# Altium project EinkFootPedal.PrjPcb
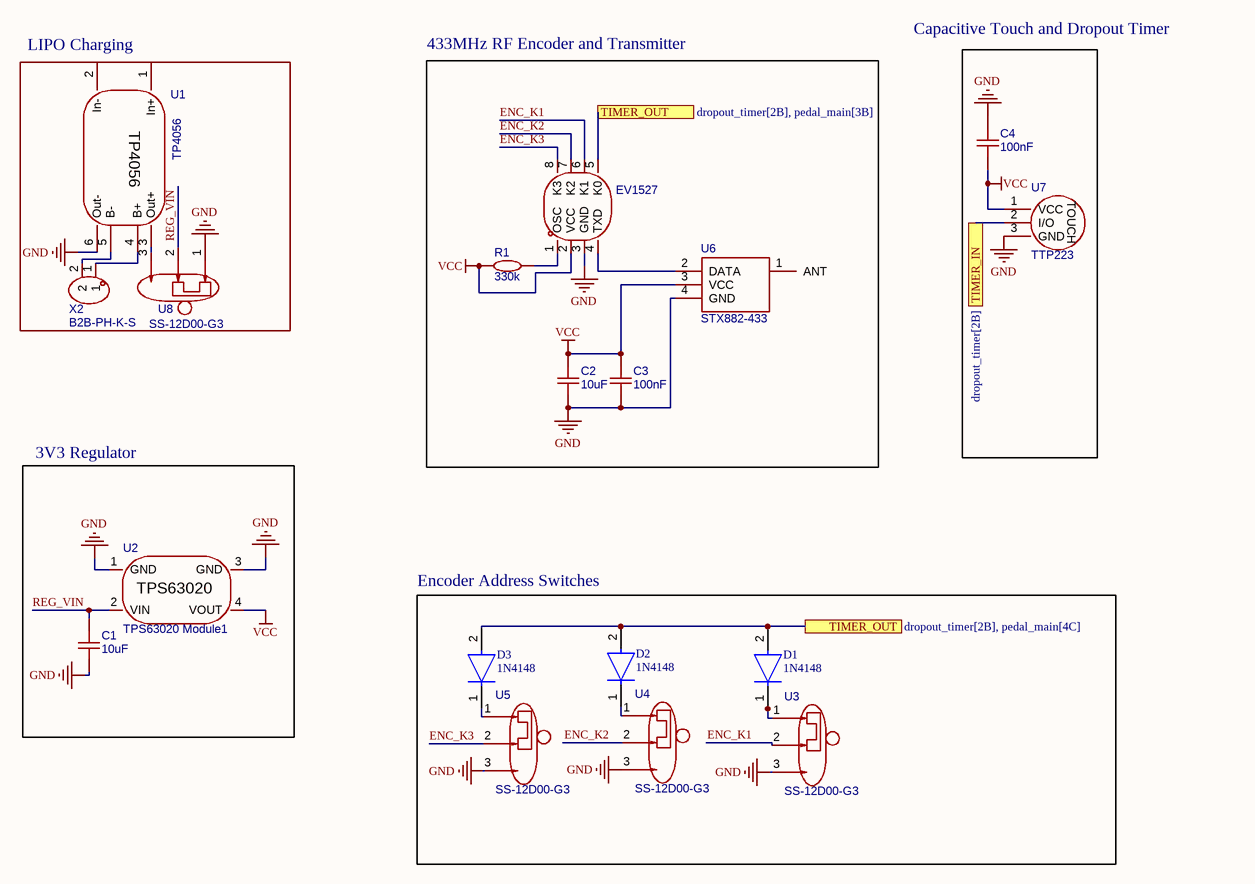
[diagram p0: pedal_main.SchDoc]
2 sheets, 23 parts. Net scope: flat (ports and power ports of the same name join across sheets).
Board file: pedal_pcb.PcbDoc
Sheets:
  pedal_main.SchDoc
  dropout_timer.SchDoc

## Sheet pedal_main.SchDoc
size B; SheetNumber: 1; SheetTotal: 2

### Parts
C1  10uF  [C0603]
C2  10uF  [C0603]
C3  100nF  [C0603]
C4  100nF  [C0603]
D1  1N4148  [FP-017AG-MFG]
D2  1N4148  [FP-017AG-MFG]
D3  1N4148  [FP-017AG-MFG]
R1  330k  [R0603]
U1  TP4056  [BATTMODULE]
U2  TPS63020 Module1  [TPS63020 MODULE AIOT]
U3  SS-12D00-G3  [SW-TH_3P-L8.8-W3.9-P2.50_SS12D00G3]
U4  SS-12D00-G3  [SW-TH_3P-L8.8-W3.9-P2.50_SS12D00G3]
U5  SS-12D00-G3  [SW-TH_3P-L8.8-W3.9-P2.50_SS12D00G3]
U6  STX882-433  [STX882_NiceRF_12x15.2]
U7  TTP223  [TTP223]
U8  SS-12D00-G3  [SW-TH_3P-L8.8-W3.9-P2.50_SS12D00G3]
X2  B2B-PH-K-S  [CONN-TH_B2B-PH-K-S]
  EV1527  [SOP-8_L4.9-W3.9-P1.27-LS6.0-TL]

### Blocks framed on the sheet
433MHz RF Encoder and Transmitter: C2 C3 R1 U6 
LIPO Charging: U1 U8 X2
3V3 Regulator: C1 U2
Encoder Address Switches: D1-D3 U3-U5

### Ports
TIMER_IN (see dropout_timer[2B]), TIMER_OUT (see dropout_timer[2B], pedal_main[3B]), TIMER_OUT (see dropout_timer[2B], pedal_main[4C])

### Nets
GND: C1.2 C2.2 C3.2 C4.2 U1.6(Out-) U2.1(GND) U2.3(GND) U3.3 U4.3 U5.3 U6.4(GND) U7.3(GND) U8.1 .3(GND)
VCC: C2.1 C3.1 C4.1 R1.1 U2.4(VOUT) U6.3(VCC) U7.1(VCC) .2(VCC)
ENC_K1: U3.2 .6(K1)
ENC_K2: U4.2 .7(K2)
ENC_K3: U5.2 .8(K3)
REG_VIN: C1.1 U2.2(VIN) U8.2
TIMER_VIN: U7.2(I/O) ; port TIMER_IN
NetD1_1: D1.1(C) U3.1
NetD1_2: D1.2(A) D2.2(A) D3.2(A) .5(K0) ; port TIMER_OUT
NetD2_1: D2.1(C) U4.1
NetD3_1: D3.1(C) U5.1
NetR1_2: R1.2 .1(OSC)
NetU1_3: U1.3(Out+) U8.3
NetU1_4: U1.4(B+) X2.1
NetU1_5: U1.5(B-) X2.2
NetU6_2: U6.2(DATA) .4(TXD)

Not connected (* = marked no-connect by the designer): U1 1(In+) 2(In-); U6 1(ANT)

### Notes on the sheet
- Capacitive Touch and Dropout Timer
- DWG. NO.
- REV.
- SHT.
- THIS DOCUMENT AND THE DATA DISCLOSED HEREIN OR HEREWITH IS THE PROPERTY OF ALTIUM LIMITED AND MAY BE FREELY DISTRIBUTED IN WHOLE. NO RIGHTS ARE RESERVED OR EXPRESS OR IMPLIED WARANTEE GIVEN.
- REVISION
- DESCRIPTION
- DATE
- APPROVED
- ENG:
- APPROVALS
- PROJECT
- DSN:
- CHK:
- REFERENCE DOCUMENTS
- PROJECT REVISION:
- TITLE
- DOCUMENT REVISION:
- DESIGN ITEM:
- BOM:
- FAB DWG:
- PCB DWG:
- ASSY DWG:
- SCALE:
- SIZE
- B
- CAGE CODE
- FILE NAME
- DWG NO.
- SHEET
- OF
- REV
- (in symbol TTP223) TOUCH

### Library data of the parts
C1 C2 = CAP_0603: Symbol: CAP_OLD; ConvertToPcb: yes; ModelId: 624118aa3cc7497086c383c2d72e0852ÂŽ0819f05c4eef4c71ace90d822a990e87; ModelName: C0603_L1.6-W0.8-H0.8; ModelTransform: 62.992,31.496,0,0,0,0,0,0,0; Device: CAP_0603; Value: 10uF; AddInBom: yes; Supplier Footprint: 0603; FootprintName: C0603
C3 C4 = CAP_0603_1: Symbol: CAP_OLD; ConvertToPcb: yes; ModelId: 624118aa3cc7497086c383c2d72e0852ÂŽ0819f05c4eef4c71ace90d822a990e87; ModelName: C0603_L1.6-W0.8-H0.8; ModelTransform: 62.992,31.496,0,0,0,0,0,0,0; Device: CAP_0603; AddInBom: yes; Supplier Footprint: 0603; FootprintName: C0603; Value: 100nF
D1-D3 = CMP-07163-000046-1: DIODE GEN PURP 100V 200MA DO35; Forward Voltage: 1V; Max Power Dissipation: 500mW; Max Reverse Current: 5uA; Forward Current: 300mA; Current: 4A; Reverse Recovery Time: 4ns; Element Configuration: Single; Outside Diameter: 1.85mm; Capacitance: 4pF; Polarity: Standard; Max Forward Surge Current (Ifsm): 1A; Reverse Voltage: 100V; Output Current: 200mA; Average Rectified Current: 200mA; Diameter: 1.91mm; Max Repetitive Reverse Voltage (Vrrm): 100V; Current Rating: 200mA; Case/Package: DO-35; Lead Free: Lead Free; Number of Pins: 2; Recovery Time: 4ns; Packaging: Bulk; Contact Plating: Tin; Voltage: 100V; Mount: Through Hole; Max Surge Current: 4A; Package Quantity: 2000; Width: 1.91mm; Max Reverse Voltage (DC): 100V; Length: 4.56mm; Radiation Hardening: No; Power Dissipation: 500mW; Voltage Rating (DC): 100V; Peak Non-Repetitive Surge Current: 4A; REACH SVHC: No SVHC; Height: 4.56mm; Max Operating Temperature: 175°C; Series: -; Weight: 0.01lb; Min Operating Temperature: -65°C
R1 = Res_0603: Symbol: Res; ConvertToPcb: yes; ModelId: 112863783b5b41f1b5254f87eedc7932ÂŽ0819f05c4eef4c71ace90d822a990e87; ModelTransform: 31.8897,63.7794,0,90,0,0,0,0,0; Device: Res_0603; Value: 330k; AddInBom: yes; Supplier Footprint: 0603; FootprintName: R0603; ModelName: R0603
U1 = TP4056: ManufacturerPart: TP4056 Lithium Battery Charger Module; AddInBom: yes; ModelId: e423d71e48284fa8aca64bd540eddcc7ÂŽ12eb6a14b26044868d603fa342c20fc9; ModelTransform: 1123.969599391241,677.16402,166.0550894347883,0,0,0,519.68504,330.70866,0; Symbol: TP4056; Device: TP4056; ConvertToPcb: yes; FootprintName: BATTMODULE; ModelName: TP4056
U2 = TPS63020: TPS63020 (Buck-Boost); AddInBom: yes; Symbol: TPS63020; Device: TPS63020; ConvertToPcb: yes; FootprintName: TPS63020 MODULE AIOT
U3-U5 U8 = SS-12D00-G3: Circuit:SPDT Actuator Style:Rectangular Columnar Termination Style:PC Pin Length:8.8mm Width:3.9mm Switch Height:7.2mm Mounting Type:Through Hole Actuator Color:Black Operating Temperature:-35℃~+75℃ Operating Temperature:-35℃~+75℃; Manufacturer: SOFNG(硕方); AddInBom: yes; ModelId: 73abde54055d465790e8480c42fb2657ÂŽ0819f05c4eef4c71ace90d822a990e87; ModelTransform: 346.495,153.54304,0,0,0,0,0,0,-102.362; Circuit: SPDT; Switch Height: 7.2mm; Actuator Color: Black; Symbol: SS-12D00-G3; Device: SS-12D00-G3; LCSC Part Name: 大型拨动开关; SupplierPart: C22355741; ManufacturerPart: SS-12D00-G3; Supplier Footprint: 插件-3P,8.8x3.9mm; JLCPCB Part Class: Extended Part; Datasheet: https://item.szlcsc.com/datasheet/SS-12D00-G3/23787622.html; Supplier: LCSC; ConvertToPcb: yes; FootprintName: SW-TH_3P-L8.8-W3.9-P2.50_SS12D00G3; ModelName: SW-TH_3P-L8.8-W3.9-P2.50_SS12D00G3; Actuator Style: Rectangular Columnar; Termination Style: PC Pin; Length: 8.8mm; Width: 3.9mm; Mounting Type: Through Hole; Operating Temperature: -35℃~+75℃
U6 = STX882-433: NiceRF STX882 433.92MHz ASK/OOK transmitter, 12.00x15.20mm, 3x2.54mm header + corner ANT pad; Symbol: STX882_NiceRF; ModelTransform: 0, 0, 0, 0, 0, 0, 0, 0, 0; AddInBom: yes; Device: STX882-433; ConvertToPcb: yes; FootprintName: STX882_NiceRF_12x15.2
U7 = TTP223: AddInBom: yes; ModelId: d48ae1b8fed1494d82694b8c5cf2b6f8ÂŽ0819f05c4eef4c71ace90d822a990e87; ModelName: COMM-TH_L15.0-W11.0_TTP223; ModelTransform: 590.54,433.06,295.27,90,0,0,0,0,0; Symbol: TTP223; Device: TTP223; ConvertToPcb: yes; FootprintName: TTP223
X2 = B2B-PH-K-S: Pins Structure:1x2P Pitch:2mm Mounting Style:Direct Insert Reference Series:PH Number of Pins:2P Number of Rows:1 Number of PINs Per Row:2 Row Spacing:- Current Rating (Max):2A Contact Material:Brass Contact Plating:Tin Operating Temperature Range:-25℃~+8; Manufacturer: JST; AddInBom: yes; ModelId: 5cc63648eb1041ff813a836ee0942c91ÂŽ0819f05c4eef4c71ace90d822a990e87; ModelName: CONN-TH_PH2.00-LI-2P; ModelTransform: 236.25937,181.102,0,180,0,0,0,23.622,-137.795; Pins Structure: 1x2P; Pitch: 2mm; Reference Series: PH; Number of PINs Per Row: 2; Current Rating (Max): 2A; Rated Voltage (Max): 100V; Plastic Material: PA66; Flame Retardant Rating: UL94V-0; Supplementary Features: K-leg punch; Z-Height of the Board: 6mm; X-Length of Bottom Edge on Board (Spacing Line): 5.9mm; Y-Width of Bottom Edge on Board: 4.5mm; Symbol: B2B-PH-K-S; Device: B2B-PH-K-S; LCSC Part Name: 1x2P 间距:2mm 直插 系列:PH; SupplierPart: C20504437; ManufacturerPart: B2B-PH-K-S; Supplier Footprint: 插件,P=2mm; JLCPCB Part Class: Extended Part; Datasheet: https://atta.szlcsc.com/upload/public/pdf/source/20181010/C265101_22107ACC4D8714694FDA2DD97145FA81.pdf; Supplier: LCSC; ConvertToPcb: yes; FootprintName: CONN-TH_B2B-PH-K-S; Mounting Style: Direct Insert; Number of Pins: 2P; Number of Rows: 1; Row Spacing: -; Contact Material: Brass; Contact Plating: Tin; Operating Temperature Range: -25℃~+85℃; Colour: White
 = EV1527: Symbol: EV1527_C2764439; AddInBom: yes; ModelId: 1637369e3845406d90068fbde42645d6ÂŽ0819f05c4eef4c71ace90d822a990e87; ModelName: SOP-8_L4.9-W3.9-H1.45-LS6.0-P1.27; ModelTransform: 236.22,189.751,0,0,0,0,-0.005,0.003,0

## Sheet dropout_timer.SchDoc
size A; SheetNumber: 2; SheetTotal: 2
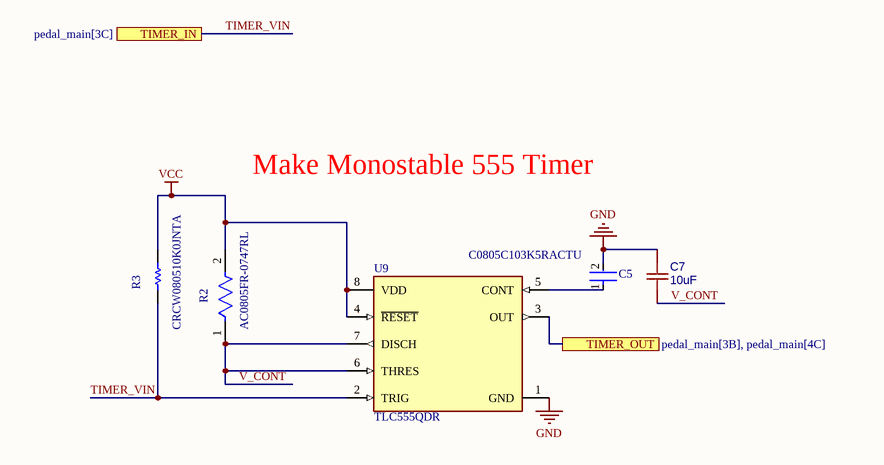
[diagram p1: dropout_timer.SchDoc]

### Parts
C5  C0805C103K5RACTU  [FP-C0805C-DN-MFG]
C7  10uF  [C0603]
R2  AC0805FR-0747RL  [FP-AC0805-MFG]
R3  CRCW080510K0JNTA  [RESC2013X50X30LL20T20]
U9  TLC555QDR  [FP-D0008A-IPC_C]

### Ports
TIMER_IN (see pedal_main[3C]), TIMER_OUT (see pedal_main[3B], pedal_main[4C])

### Nets
GND: C5.2 C7.2 U9.1(GND)
VCC: R2.2 R3.2 U9.4(~{RESET}) U9.8(VDD)
TIMER_VIN: R3.1 U9.2(TRIG) ; port TIMER_IN
V_CONT: C7.1 R2.1 U9.6(THRES) U9.7(DISCH)
NetC5_1: C5.1 U9.5(CONT)
NetD1_2: U9.3(OUT) ; port TIMER_OUT

### Notes on the sheet
- Make Monostable 555 Timer

### Library data of the parts
C5 = CMP-2007-01079-2: CAP CER 10000PF 50V X7R 0805; Manufacturer: KEMET; Capacitance: 10,000 pF; Material: Ceramic; Description: C0805 10,000 pF X7R 30ppm/°C 10.00% 50 V; Tolerance: 0.1; Value: 10,000 pF; Temperature Coefficient: 30ppm/°C; Temperature: -55°C to +125°C; Device Class L3: Ceramic Capacitors; ComponentLink2URL: https://content.kemet.com/datasheets/KEM_C1003_C0G_SMD.pdf; Temperature Range Low: -55°C; Manufacturer Part Number: C0805C103K5RACTU; Ipc Land Pattern Name: CAPC200125X78; Height: 0.88mm; Temperature Range High: +125°C; Category: Cap; ComponentLink2Description: Datasheet; Octopart: https://octopart.com/c0805c103k5ractu-kemet-90536; Package: C0805C-DN; Device Class L2: Capacitors; Voltage Rating: 50 V; RoHS: TRUE; Automotive: No; Digikey Description: CAP CER 10000PF 50V X7R 0805; Temperature Characteristic: X7R; Device Class L1: Passive Components; Lead Free: Yes
C7 = CAP_0603: as C1 on sheet pedal_main; Device: CAP_0603; Value: 10uF; AddInBom: yes; Supplier Footprint: 0603; FootprintName: C0603
R2 = CMP-03412-037772-1: RES SMD 47 OHM 1% 1/8W 0805; Manufacturer: Yageo; Resistance: 47Ω; Value: 47Ω; Voltage Rating: 150V; Tolerance: 0.01; Automotive Grade: Grade 0; Category: Res; Digikey Description: RES SMD 47 OHM 1% 1/8W 0805; Mouser Description: Thick Film Resistors - SMD 1/8W 47ohm 1% AEC-Q200; Temperature: -55°C to +155°C; Temperature Range Low: -55°C; Temperature Range High: +155°C; Device Class L2: Resistors; Composition: Thick Film; Package: AC0805; Lead Free: Yes; ComponentLink2URL: http://www.yageo.com/documents/recent/PYu-AC_51_RoHS_L_6.pdf; Automotive: Yes; Device Class L3: Chip SMD Resistors; Octopart: https://octopart.com/ac0805fr-0747rl-yageo-46503502; ComponentLink2Description: Datasheet; Power Rating: 1/8W; Height: 0.6mm; Ipc Land Pattern Name: RESC200125X50; RoHS: TRUE; Device Class L1: Passive Components; Footprint Url: http://www.yageo.com/exep/pages/download/literatures/PYu-R_Mount_10.pdf; Series: AC; Manufacturer Part Number: AC0805FR-0747RL
R3 = CMP-2001-04257-1: Manufacturer: Vishay Dale; Part Number: CRCW080510K0JNTA
U9 = CMP-04858-000019-1: IC OSC SGL TIMER 2.1MHZ 8-SOIC; Operating Supply Current: 360uA; Quiescent Current: 250uA; Min Supply Voltage: 5V; Max Power Dissipation: 725mW; Number of Timers/Counters: 1; Low Level Output Current: 100mA; High Level Output Current: -10mA; Max Supply Voltage: 15V; Frequency: 2.1MHz; Radiation Hardening: No; Contact Plating: Gold; Height: 1.58mm; Max Operating Temperature: 125°C; Package Quantity: 2500; Length: 4.9mm; Width: 3.91mm; Min Operating Temperature: -40°C; Mount: Surface Mount; Lead Free: Lead Free; Number of Pins: 8; Weight: 0.002677oz; Packaging: Tape and Reel; REACH SVHC: No SVHC; Case/Package: SOIC; Nominal Supply Current: 250uA; RoHS Compliant: Yes; Power Dissipation: 725mW

## Nets that join several sheets
GND: pedal_main (14 pins), dropout_timer (C5.2 C7.2 U9.1)
VCC: pedal_main (8 pins), dropout_timer (R2.2 R3.2 U9.4 U9.8)
NetD1_2: pedal_main (D1.2 D2.2 D3.2 .5), dropout_timer (U9.3)
TIMER_VIN: pedal_main (U7.2), dropout_timer (R3.1 U9.2)